# Altium project CLOCK_PCB.PrjPcb
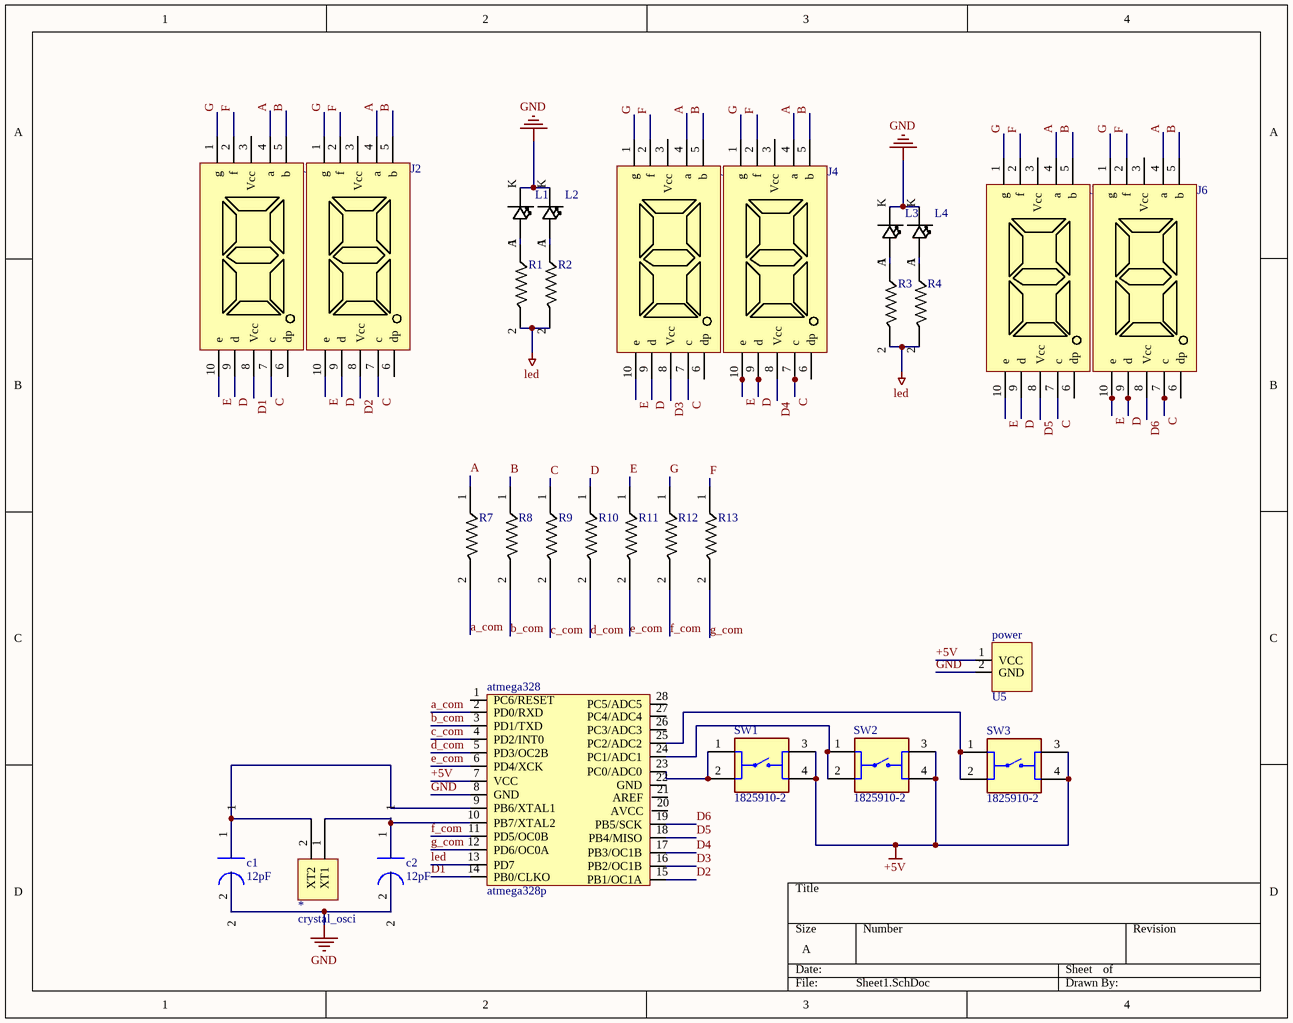
[diagram p0: Sheet1.SchDoc]
1 sheet, 29 parts. Net scope: global (net labels, ports and power ports of the same name join across sheets).
Board file: Copy of PCB1.PcbDoc

## Sheet Sheet1.SchDoc
size A; SheetNumber: 1; SheetTotal: 1

### Parts
*  crystal_osci  [crystal_16MHz]
atmega328  atmega328p  [IC_base_holder]
c1  12pF  [Capacitor0805_12pF]
c2  12pF  [Capacitor0805_12pF]
J1  7_seg_display_comm_cath  [7seg]  (value not drawn)
J2  7_seg_display_comm_cath  [7seg]  (value not drawn)
J3  7_seg_display_comm_cath  [7seg]  (value not drawn)
J4  7_seg_display_comm_cath  [7seg]  (value not drawn)
J5  7_seg_display_comm_cath  [7seg]  (value not drawn)
J6  7_seg_display_comm_cath  [7seg]  (value not drawn)
L1  RED_led  [led_LSM0805 Series_red]  (value not drawn)
L2  RED_led  [led_LSM0805 Series_red]  (value not drawn)
L3  RED_led  [led_LSM0805 Series_red]  (value not drawn)
L4  RED_led  [led_LSM0805 Series_red]  (value not drawn)
power  U5  [USB_MINI_20]
R1  resistor_150_smd  [Resistor_150_smd]  (value not drawn)
R2  resistor_150_smd  [Resistor_150_smd]  (value not drawn)
R3  resistor_150_smd  [Resistor_150_smd]  (value not drawn)
R4  resistor_150_smd  [Resistor_150_smd]  (value not drawn)
R7  resistor_1k_smd  [Resistor_ERJUP3_1K]  (value not drawn)
R8  resistor_1k_smd  [Resistor_ERJUP3_1K]  (value not drawn)
R9  resistor_1k_smd  [Resistor_ERJUP3_1K]  (value not drawn)
R10  resistor_1k_smd  [Resistor_ERJUP3_1K]  (value not drawn)
R11  resistor_1k_smd  [Resistor_ERJUP3_1K]  (value not drawn)
R12  resistor_1k_smd  [Resistor_ERJUP3_1K]  (value not drawn)
R13  resistor_1k_smd  [Resistor_ERJUP3_1K]  (value not drawn)
SW1  1825910-2  [TE_1825910-2]
SW2  1825910-2  [TE_1825910-2]
SW3  1825910-2  [TE_1825910-2]

### Nets
+5V: atmega328.7(VCC) power.1(VCC) SW1.3 SW1.4 SW2.3 SW2.4 SW3.3 SW3.4
GND: atmega328.8(GND) c1.2 c2.2 L1.K L2.K L3.K L4.K power.2(GND)
led: atmega328.13(PD7) R1.2 R2.2 R3.2 R4.2
A: J1.4(a) J2.4(a) J3.4(a) J4.4(a) J5.4(a) J6.4(a) R7.1
a_com: atmega328.2(PD0/RXD) R7.2
B: J1.5(b) J2.5(b) J3.5(b) J4.5(b) J5.5(b) J6.5(b) R8.1
b_com: atmega328.3(PD1/TXD) R8.2
C: J1.7(c) J2.7(c) J3.7(c) J4.7(c) J5.7(c) J6.7(c) R9.1
c_com: atmega328.4(PD2/INT0) R9.2
D: J1.9(d) J2.9(d) J3.9(d) J4.9(d) J5.9(d) J6.9(d) R10.1
D1: atmega328.14(PB0/CLKO) J1.8(Vcc)
D2: atmega328.15(PB1/OC1A) J2.8(Vcc)
D3: atmega328.16(PB2/OC1B) J3.8(Vcc)
D4: atmega328.17(PB3/OC1B) J4.8(Vcc)
D5: atmega328.18(PB4/MISO) J5.8(Vcc)
D6: atmega328.19(PB5/SCK) J6.8(Vcc)
d_com: atmega328.5(PD3/OC2B) R10.2
E: J1.10(e) J2.10(e) J3.10(e) J4.10(e) J5.10(e) J6.10(e) R11.1
e_com: atmega328.6(PD4/XCK) R11.2
F: J1.2(f) J2.2(f) J3.2(f) J4.2(f) J5.2(f) J6.2(f) R13.1
f_com: atmega328.11(PD5/OC0B) R12.2
G: J1.1(g) J2.1(g) J3.1(g) J4.1(g) J5.1(g) J6.1(g) R12.1
g_com: atmega328.12(PD6/OC0A) R13.2
Net*_1: *.1(XT1) atmega328.10(PB7/XTAL2) c2.1
Net*_2: *.2(XT2) atmega328.9(PB6/XTAL1) c1.1
Netatmega328_23: atmega328.23(PC0/ADC0) SW1.1 SW1.2
Netatmega328_24: atmega328.24(PC1/ADC1) SW2.1 SW2.2
Netatmega328_25: atmega328.25(PC2/ADC2) SW3.1 SW3.2
NetL1_A: L1.A R1.1
NetL2_A: L2.A R2.1
NetL3_A: L3.A R3.1
NetL4_A: L4.A R4.1

Not connected (* = marked no-connect by the designer): atmega328 1(PC6/RESET) 20(AVCC) 21(AREF) 22(GND) 26(PC3/ADC3) 27(PC4/ADC4) 28(PC5/ADC5); J1 3(Vcc) 6(dp); J2 3(Vcc) 6(dp); J3 3(Vcc) 6(dp); J4 3(Vcc) 6(dp); J5 3(Vcc) 6(dp); J6 3(Vcc) 6(dp)

### Library data of the parts
c1 c2 = capacitor12pico
power = USB CONNECTOR
SW1-SW3 = 1825910-2: SWITCH TACTILE SPST-NO 0.05A 24V; Package: None; MP: 1825910-2; Value: *; Price: None; Availability: Unavailable